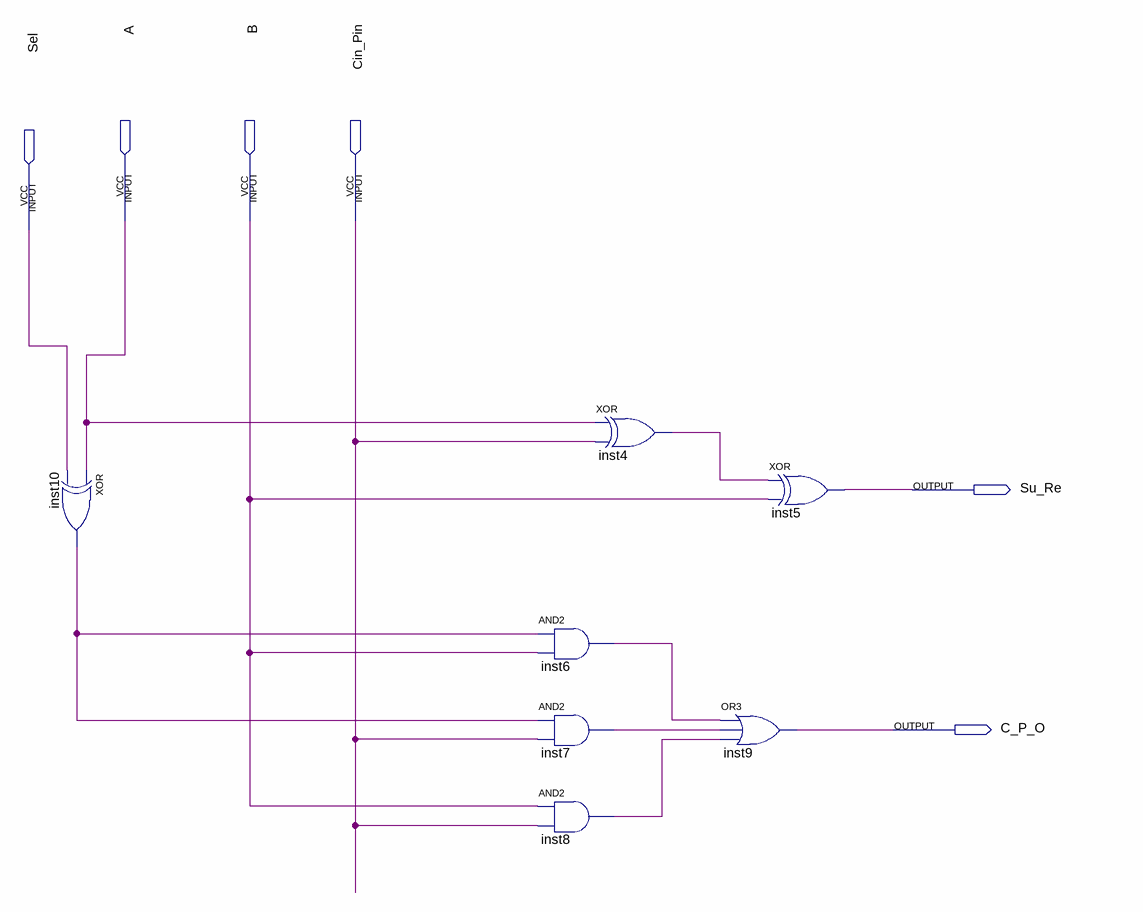
[diagram p0: schematic sheet]
// Quartus schematic Sum_Tes_1B.bdf as structural Verilog: 7 symbols, 6 pins
module Sum_Tes_1B (
  input  A,
  input  B,
  input  Cin_Pin,
  input  Sel,
  output Su_Re,
  output C_P_O
);

  wire inst4_out, inst6_out, inst7_out, inst8_out, inst10_out;

  xor inst10 (inst10_out, A, Sel);
  and inst6 (inst6_out, inst10_out, B);
  and inst7 (inst7_out, inst10_out, Cin_Pin);
  and inst8 (inst8_out, B, Cin_Pin);
  xor inst4 (inst4_out, A, Cin_Pin);
  xor inst5 (Su_Re, inst4_out, B);
  or inst9 (C_P_O, inst6_out, inst7_out, inst8_out);
endmodule
